# EAGLE design speakermodule (EAGLE 9.6.2)
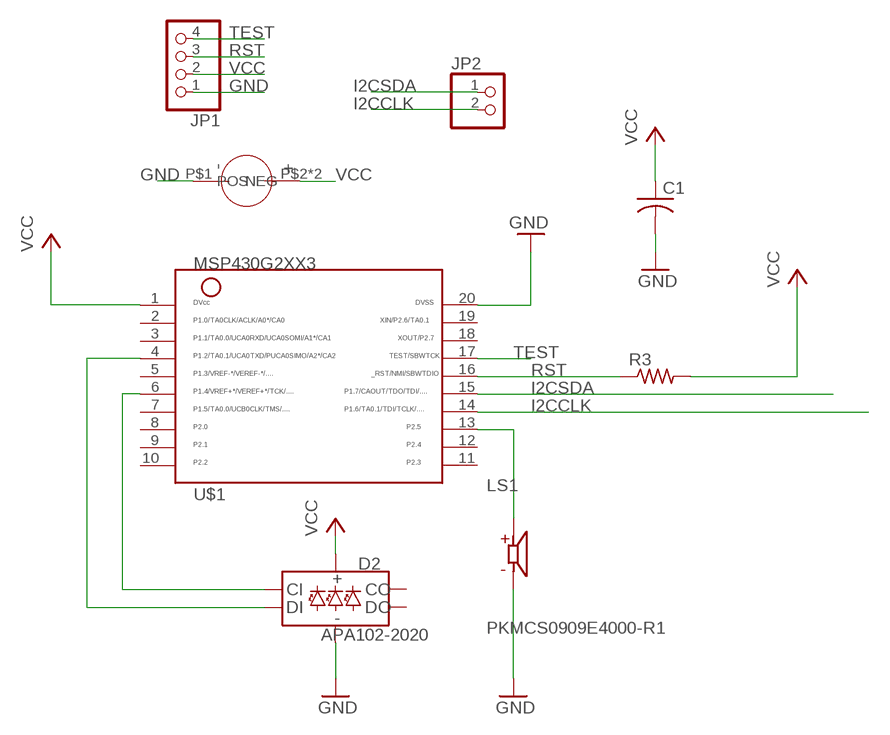
[diagram p0: schematic, sheet 1]

## Parts
C1  C-USC1206  [C1206]
D2  APA102-2020  [APA102-2020]
JP1  PINHD-1X4  [1X04]
JP2  PINHD-1X2  [1X02]
LS1  PKMCS0909E4000-R1  [SPKR_PKMCS0909E4000-R1]
R3  R-US_R1206  [R1206]
U$1  MSP430G2XX3TSSOP  [PW20]
U$3  3002BATTERY  [3002BATTERY]

## Nets
GND: C1.2 D2.GND JP1.1 LS1.2(N) U$1.20 U$3.P$1(NEG)
I2CCLK: JP2.2 U$1.14
I2CSDA: JP2.1 U$1.15
N$1: LS1.1(P) U$1.13
N$5: D2.CKI(CI) U$1.6
N$6: D2.SDI(DI) U$1.4
RST: JP1.3 R3.1 U$1.16
TEST: JP1.4 U$1.17
VCC: C1.1 D2.VDD(VCC) JP1.2 R3.2 U$1.1 U$3.P$2(POS) U$3.P$3(POS)
Unconnected: D2.CKO(CO) D2.SDO(DO) U$1.2 U$1.3 U$1.5 U$1.7 U$1.8 U$1.9 U$1.10 U$1.11 U$1.12 U$1.18 U$1.19

## Library data of the parts
C1 = rcl:C-US: CAPACITOR, American symbol; SPICEPREFIX: C
D2 = SparkFun-LED:APA102: Addressable RGB LED - 2 Wire Common names: APA102, Dotstar, etc. Packages: 5050 2020 SparkFun Products: SparkFun Lumenati Boards <https://www.sparkfun.com/categories/405>; PROD_ID: DIO-14111
JP1 = pinhead:PINHD-1X4: PIN HEADER
JP2 = pinhead:PINHD-1X2: PIN HEADER
LS1 = PKMCS0909E4000-R1:PKMCS0909E4000-R1: Buzzers Transducer, Externally Driven Piezo 1.5V 4kHz 65dB @ 1.5V, 10cm Surface Mount Solder Pads; DESCRIPTION: Buzzers Transducer, Externally Driven Piezo 1.5V 4kHz 65dB @ 1.5V, 10cm Surface Mount Solder Pads; DIGI-KEY_PART_NUMBER: 490-9647-1-ND; MF: Murata; MP: PKMCS0909E4000-R1; PACKAGE: SMD-2 Murata; PURCHASE-URL: https://pricing.snapeda.com/search/part/PKMCS0909E4000-R1/?ref=eda
R3 = rcl:R-US_: RESISTOR, American symbol; SPICEPREFIX: R
U$1 = ELEC327:MSP430G2XX3: MSP430G2XX3 PDIP (N) 20 Pin Package
U$3 = Personal:3002BATTERY: 3002 Battery Holder Digikey <https://www.digikey.com/en/products/detail/keystone-electronics/3002/227444> Drawing <https://www.digikey.com/htmldatasheets/production/846798/0/0/1/3002-drawing.html>

## Board
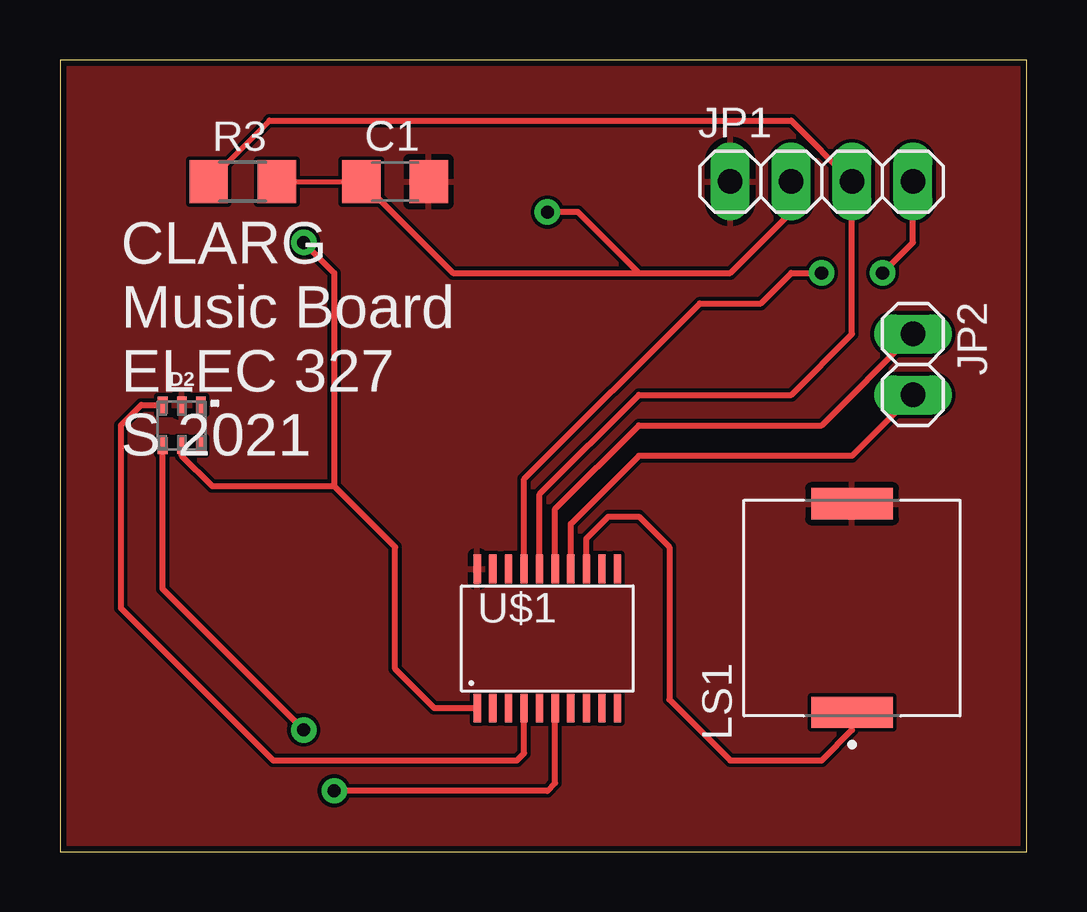
[diagram p1: board, top side]
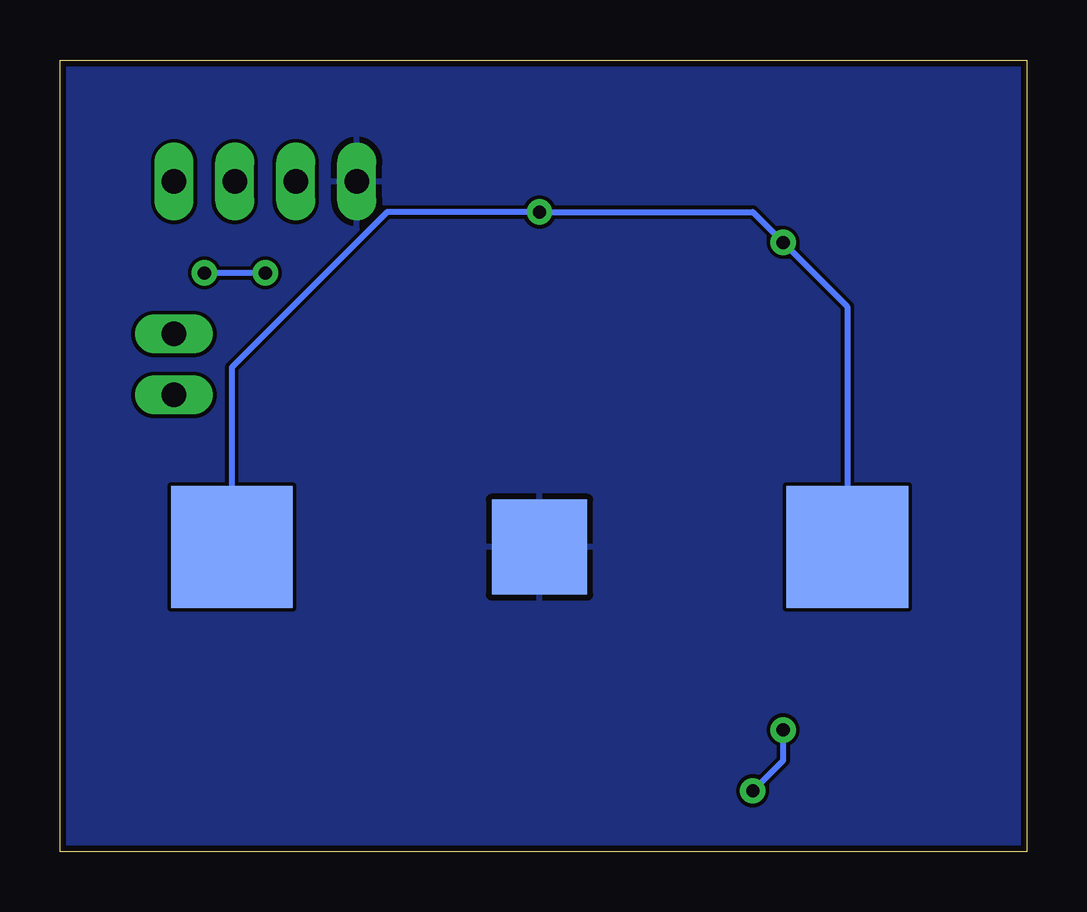
[diagram p2: board, bottom side, seen from below]

Size 40.31 x 33.01 mm. Coordinates in mm from the lower left corner, seen from the top.
Outline: 0,0 40.31,0 40.31,33.01 0,33.01 0,0
Copper layers (1*16): Top 0.035mm / dielectric 1.5mm / Bottom 0.035mm
Design rules "AdvancedCircuitsBarebones": minimum track width 6mil, minimum drill 20mil, track to track 6mil, track to pad 6mil, pad to pad 6mil, via to via 6mil, smd to smd 6mil, copper to edge 10mil, drill to drill 6mil, minimum pad ring 12mil, minimum via ring 10mil, stop-mask expansion 4mil, vias tented up to drill 25mil, thermal gap 10mil

### Footprints (pad centres in the part's own frame; a part is rotated, then mirrored left to right if it is on the bottom)
C1206 = smd 1.6 x 1.8: 1 -1.4,0; 2 1.4,0
APA102-2020 = smd 0.4 x 0.7: CKI -0.8,-0.85; CKO 0.8,-0.85; GND 0,0.85; SDI -0.8,0.85; SDO 0.8,0.85; VDD 0,-0.85
1X04 = drill 1.016 long: 1 -3.81,0; 2 -1.27,0; 3 1.27,0; 4 3.81,0
1X02 = drill 1.016 long: 1 -1.27,0; 2 1.27,0
SPKR_PKMCS0909E4000-R1 = smd 1.3 x 3.4: 1 -4.35,0; 2 4.35,0
R1206 = smd 1.6 x 1.803: 1 -1.422,0; 2 1.422,0
PW20 = smd 0.3 x 1.2: 1 -2.925,-2.9; 2 -2.275,-2.9; 3 -1.625,-2.9; 4 -0.975,-2.9; 5 -0.325,-2.9; 6 0.325,-2.9; 7 0.975,-2.9; 8 1.625,-2.9; 9 2.275,-2.9; 10 2.925,-2.9; 11 2.925,2.9; 12 2.275,2.9; 13 1.625,2.9; 14 0.975,2.9; 15 0.325,2.9; 16 -0.325,2.9; 17 -0.975,2.9; 18 -1.625,2.9; 19 -2.275,2.9; 20 -2.925,2.9
3002BATTERY = smd 3.96 x 3.96: P$1 0,0 | smd 5.08 x 5.08: P$2 12.825,0; P$3 -12.825,0

### Placement (x,y rotation side)
C1  13.97,27.94 0 top
D2  5.08,17.78 0 top
JP1  31.75,27.94 0 top
JP2  35.56,20.32 270 top
LS1  33.02,10.16 90 top
R3  7.62,27.94 0 top
U$1  20.32,8.89 0 top
U$3  20.32,12.7 180 bottom

### Tracks (layer width: path | path; a pad name or v marks a point on that pad's centre or on a via)
GND
  pour Top: 0,0 0,33.02 40.64,33.02 40.64,0
  pour Bottom: 0,0 0,33.02 40.64,33.02 40.64,0
I2CCLK
  Top 0.254: U$1.14 21.29,13.68 24.13,16.51 33.02,16.51 JP2.2
I2CSDA
  Top 0.254: U$1.15 20.64,14.3 24.13,17.78 31.75,17.78 JP2.1
N$1
  Top 0.254: LS1.1 33.02,5.08 31.75,3.81 27.94,3.81 25.4,6.35 25.4,12.7 24.13,13.97 22.86,13.97 21.95,13.05 U$1.13
N$5  (via drill 0.55)
  Top 0.254: v11.43,2.54 20.32,2.54 20.64,2.87 U$1.6 | v10.16,5.08 4.28,10.96 D2.CKI
  Bottom 0.254: v11.43,2.54 10.16,3.81 v10.16,5.08
N$6
  Top 0.254: D2.SDI 3.39,18.63 2.54,17.78 2.54,10.16 8.89,3.81 19.05,3.81 19.34,4.11 U$1.4
RST
  Top 0.203: R3.1 8.74,30.48
  Top 0.254: 8.74,30.48 30.48,30.48 JP1.3 33.02,21.59 30.48,19.05 24.13,19.05 20,14.91 U$1.16
TEST  (via drill 0.55)
  Top 0.254: U$1.17 19.34,15.54 26.67,22.86 29.21,22.86 30.48,24.13 v31.75,24.13 | v34.29,24.13 35.56,25.4 JP1.4
  Bottom 0.254: v31.75,24.13 v34.29,24.13
VCC  (via drill 0.55)
  Top 0.203: R3.2 C1.1
  Top 0.254: U$1.1 15.6,5.99 13.97,7.62 13.97,12.7 11.43,15.24 | C1.1 16.38,24.13 24.13,24.13 | 24.13,24.13 27.94,24.13 30.48,26.67 JP1.2 | 11.43,15.24 6.35,15.24 5.08,16.51 D2.VDD | 24.13,24.13 21.59,26.67 v20.32,26.67 | v10.16,25.4 11.43,24.13 11.43,15.24
  Bottom 0.254: U$3.P$3 7.49,22.73 v10.16,25.4 11.43,26.67 v20.32,26.67 26.67,26.67 33.15,20.2 U$3.P$2

### Text on the board
_tsilk: CLARG / Music Board / ELEC 327 / S 2021